# EAGLE design matrix+segmen_shalat (EAGLE 9.5.2)

## Sheet 1 of 2
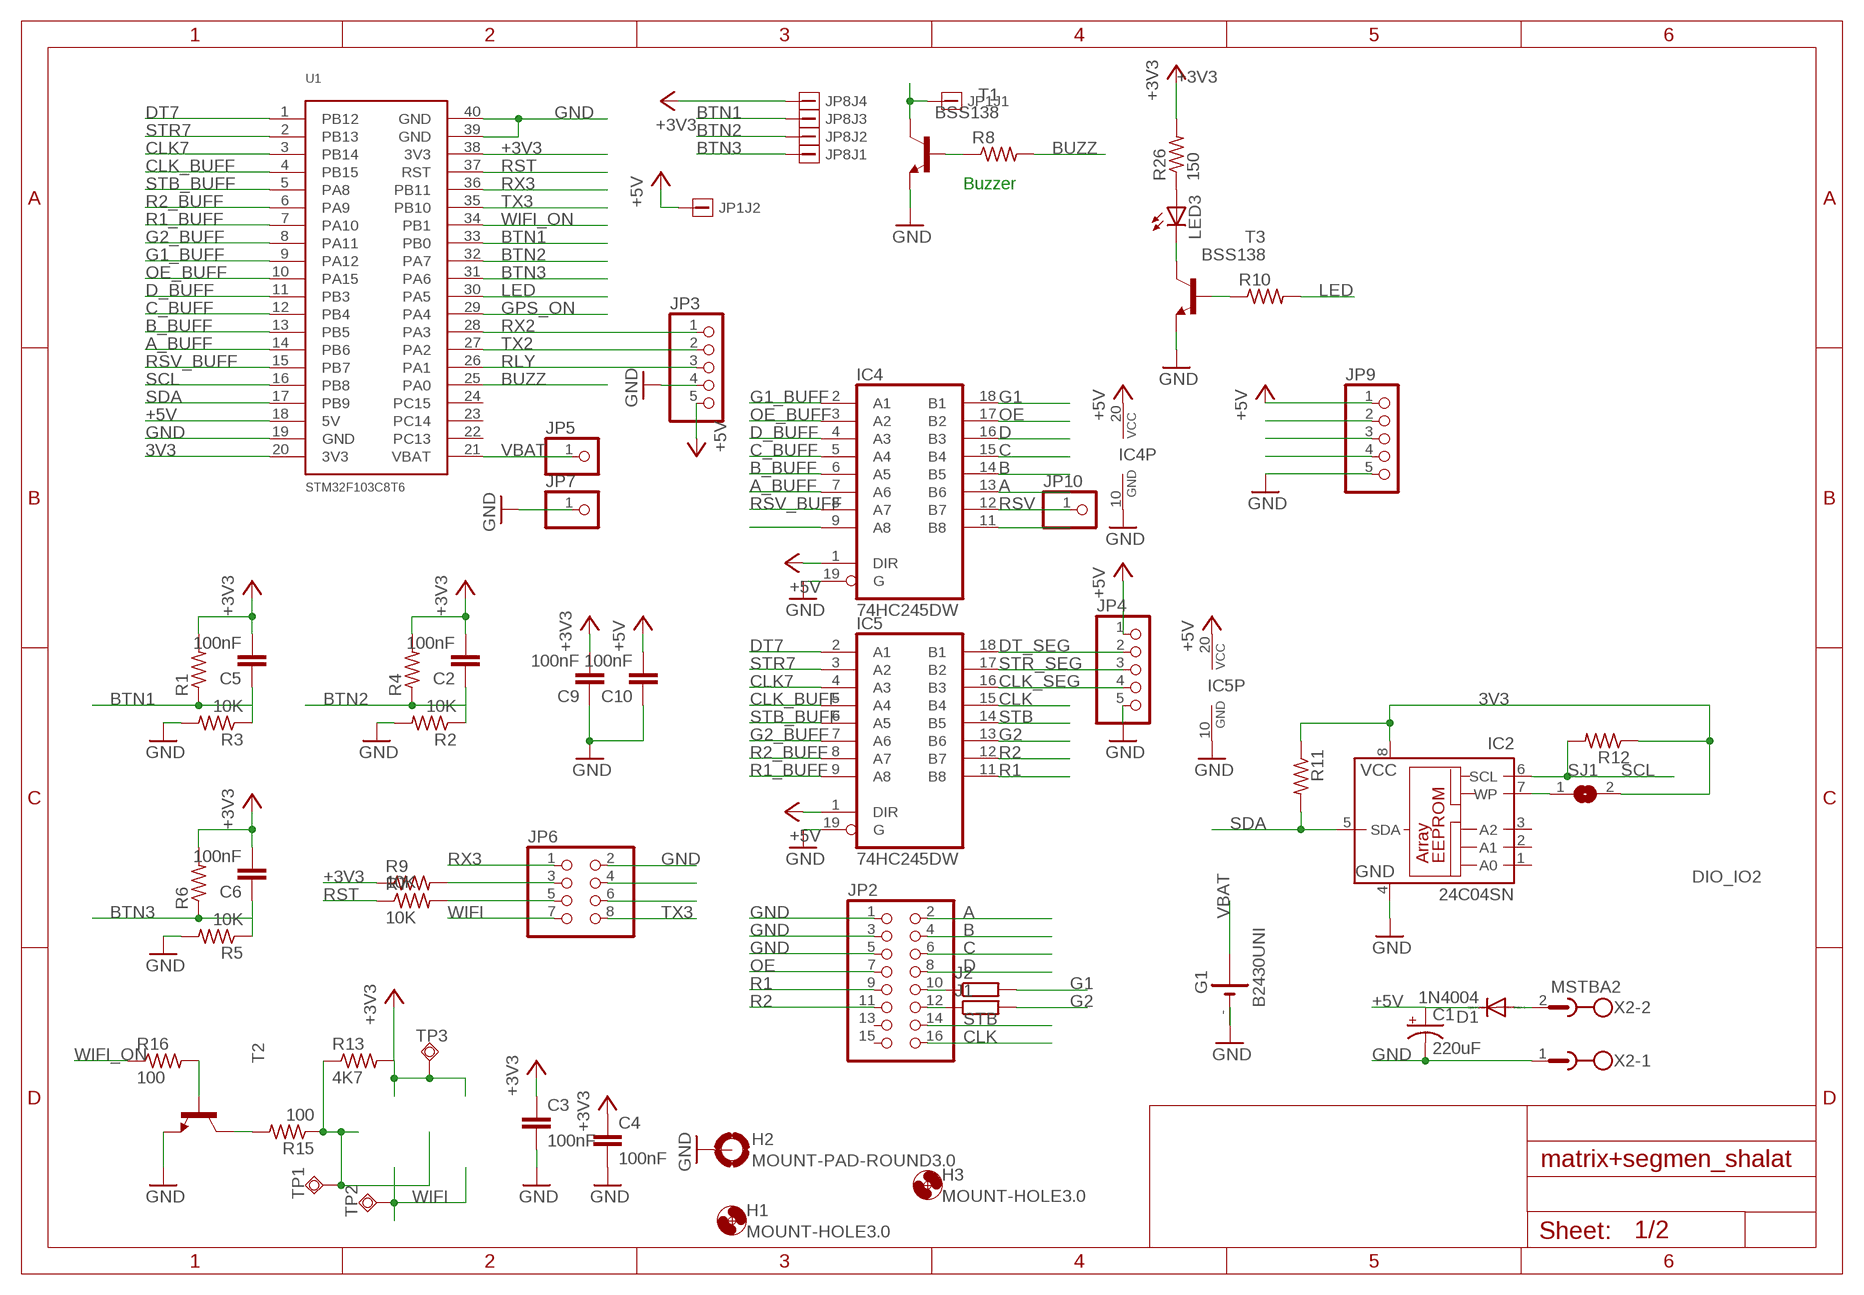
[diagram p0: schematic, sheet 1]

### Parts
C1  220uF  CPOL-USE3.5-8  [E3,5-8]
C2  100nF  C-EUC0805  [C0805]
C3  100nF  C-EUC0805  [C0805]
C4  100nF  C-EUC0805  [C0805]
C5  100nF  C-EUC0805  [C0805]
C6  100nF  C-EUC0805  [C0805]
C9  100nF  C-EUC0805  [C0805]
C10  100nF  C-EUC0805  [C0805]
D1  1N4004  [DO41-10]
G1  B2430UNI  [B2430UNI]
H1  MOUNT-HOLE3.0  [3,0]
H2  MOUNT-PAD-ROUND3.0  [3,0-PAD]
H3  MOUNT-HOLE3.0  [3,0]
IC2  24C04SN  [SO-08]
IC4  74HC245DW  [SO20W]
IC5  74HC245DW  [SO20W]
J1  R-EU_R0402  [R0402]
J2  R-EU_R0402  [R0402]
JP1  CON2-3.81  [CON2-3.81]
JP2  PINHD-2X8  [2X08]
JP3  PINHD-1X5  [1X05]
JP4  PINHD-1X5  [1X05]
JP5  PINHD-1X1  [1X01]
JP6  PINHD-2X4  [2X04]
JP7  PINHD-1X1  [1X01]
JP8  CON4-3.81  [CON4-3.81]
JP9  PINHD-1X5  [1X05]
JP10  PINHD-1X1  [1X01]
LED3  LED3MM  [LED3MM]
R1  R-US_0204/2V  [0204V]
R2  10K  R-US_M0805  [M0805]
R3  10K  R-US_M0805  [M0805]
R4  R-US_0204/2V  [0204V]
R5  10K  R-US_M0805  [M0805]
R6  R-US_0204/2V  [0204V]
R7  10K  R-US_R0805  [R0805]
R8  R-US_R0805  [R0805]
R9  10K  R-US_R0805  [R0805]
R10  R-US_R0805  [R0805]
R11  R-US_R0805  [R0805]
R12  R-US_R0805  [R0805]
R13  4K7  R-US_R0805  [R0805]
R15  100  R-US_R0805  [R0805]
R16  100  R-US_R0805  [R0805]
R26  150  R-US_R0805  [R0805]
SJ1  SJ  [SJ]
T1  BSS138  MMBT2222ALT1-NPN-SOT23-BEC  [SOT23-BEC]
T2  MMBT2222ALT1-NPN-SOT23-BEC  [SOT23-BEC]
T3  BSS138  MMBT2222ALT1-NPN-SOT23-BEC  [SOT23-BEC]
TP1  TPSQPAD1-13Y  [P1-13Y]
TP2  TPSQPAD1-13Y  [P1-13Y]
TP3  TPSQPAD1-13Y  [P1-13Y]
U1  STM32F103C8T6  [STM32F103]
X2  MSTBA2  [MSTBA2]

### Nets
3V3: IC2.8(VCC) R11.1 R12.1 SJ1.2 U1.20(3V3)
+3V3: C2.2 C3.1 C4.1 C5.2 C6.2 C9.2 JP8.4 R1.2 R4.2 R6.2 R9.1 R13.2 R26.2 TP3.TP U1.38(3V3)
+5V: C1.+ C10.2 D1.C IC4.1(DIR) IC4.20(VCC) IC5.1(DIR) IC5.20(VCC) JP1.2 JP3.5 JP4.1 JP9.1 U1.18(5V)
A: IC4.13(B6) JP2.2
A_BUFF: IC4.7(A6) U1.14(PB6)
B: IC4.14(B5) JP2.4
B_BUFF: IC4.6(A5) U1.13(PB5)
BTN1: C5.1 JP8.3 R1.1 R3.1 U1.33(PB0)
BTN2: C2.1 JP8.2 R2.1 R4.1 U1.32(PA7)
BTN3: C6.1 JP8.1 R5.1 R6.1 U1.31(PA6)
BUZZ: R8.2 U1.25(PA0)
C: IC4.15(B4) JP2.6
C_BUFF: IC4.5(A4) U1.12(PB4)
CLK: IC5.15(B4) JP2.16
CLK7: IC5.4(A3) U1.3(PB14)
CLK_BUFF: IC5.5(A4) U1.4(PB15)
CLK_SEG: IC5.16(B3) JP4.4
D: IC4.16(B3) JP2.8
D_BUFF: IC4.4(A3) U1.11(PB3)
DT7: IC5.2(A1) U1.1(PB12)
DT_SEG: IC5.18(B1) JP4.2
G1: IC4.18(B1) J2.2
G1_BUFF: IC4.2(A1) U1.9(PA12)
G2: IC5.13(B6) J1.2
G2_BUFF: IC5.7(A6) U1.8(PA11)
GND: C1.- C3.2 C4.2 C9.1 C10.1 G1.- G1.-@1(-) H2.B3,0(MOUNT) IC2.4(GND) IC4.10(GND) IC4.19(G) IC5.10(GND) IC5.19(G) JP2.1 JP2.3 JP2.5 JP3.4 JP4.5 JP6.2 JP7.1 JP9.5 R2.2 R3.2 R5.2 T1.E T2.E T3.E U1.19(GND) U1.39(GND) U1.40(GND) X2.1
GPS_ON: U1.29(PA4)
LED: R10.2 U1.30(PA5)
N$1: J1.1 JP2.12
N$2: IC4.9(A8)
N$3: LED3.K(C) T3.C
N$4: R10.1 T3.B
N$5: R8.1 T1.B
N$6: JP1.1 T1.C
N$7: JP6.3 R9.2
N$8: J2.1 JP2.10
N$9: IC4.11(B8)
N$10: JP6.4
N$13: JP9.2
N$14: JP9.3
N$15: JP9.4
N$17: R13.1 R15.1 TP1.TP
N$18: R15.2 T2.C
N$19: JP6.5 R7.2
N$20: JP6.6
N$21: R16.2 T2.B
N$29: LED3.A R26.1
N$41: D1.A X2.2
N$123: IC2.7(WP) SJ1.1
OE: IC4.17(B2) JP2.7
OE_BUFF: IC4.3(A2) U1.10(PA15)
R1: IC5.11(B8) JP2.9
R1_BUFF: IC5.9(A8) U1.7(PA10)
R2: IC5.12(B7) JP2.11
R2_BUFF: IC5.8(A7) U1.6(PA9)
RLY: JP3.3 U1.26(PA1)
RST: R7.1 U1.37(RST)
RSV: IC4.12(B7) JP10.1
RSV_BUFF: IC4.8(A7) U1.15(PB7)
RX2: JP3.1 U1.28(PA3)
RX3: JP6.1 U1.36(PB11)
SCL: IC2.6(SCL) R12.2 U1.16(PB8)
SDA: IC2.5(SDA) R11.2 U1.17(PB9)
STB: IC5.14(B5) JP2.14
STB_BUFF: IC5.6(A5) U1.5(PA8)
STR7: IC5.3(A2) U1.2(PB13)
STR_SEG: IC5.17(B2) JP4.3
TX2: JP3.2 U1.27(PA2)
TX3: JP6.8 U1.35(PB10)
VBAT: G1.+@4(+) JP5.1 U1.21(VBAT)
WIFI: JP6.7 TP2.TP
WIFI_ON: R16.1 U1.34(PB1)
Unconnected: IC2.1(A0) IC2.2(A1) IC2.3(A2) JP2.13 JP2.15 U1.22(PC13) U1.23(PC14) U1.24(PC15)

### Notes on the sheet
- Buzzer

## Sheet 2 of 2
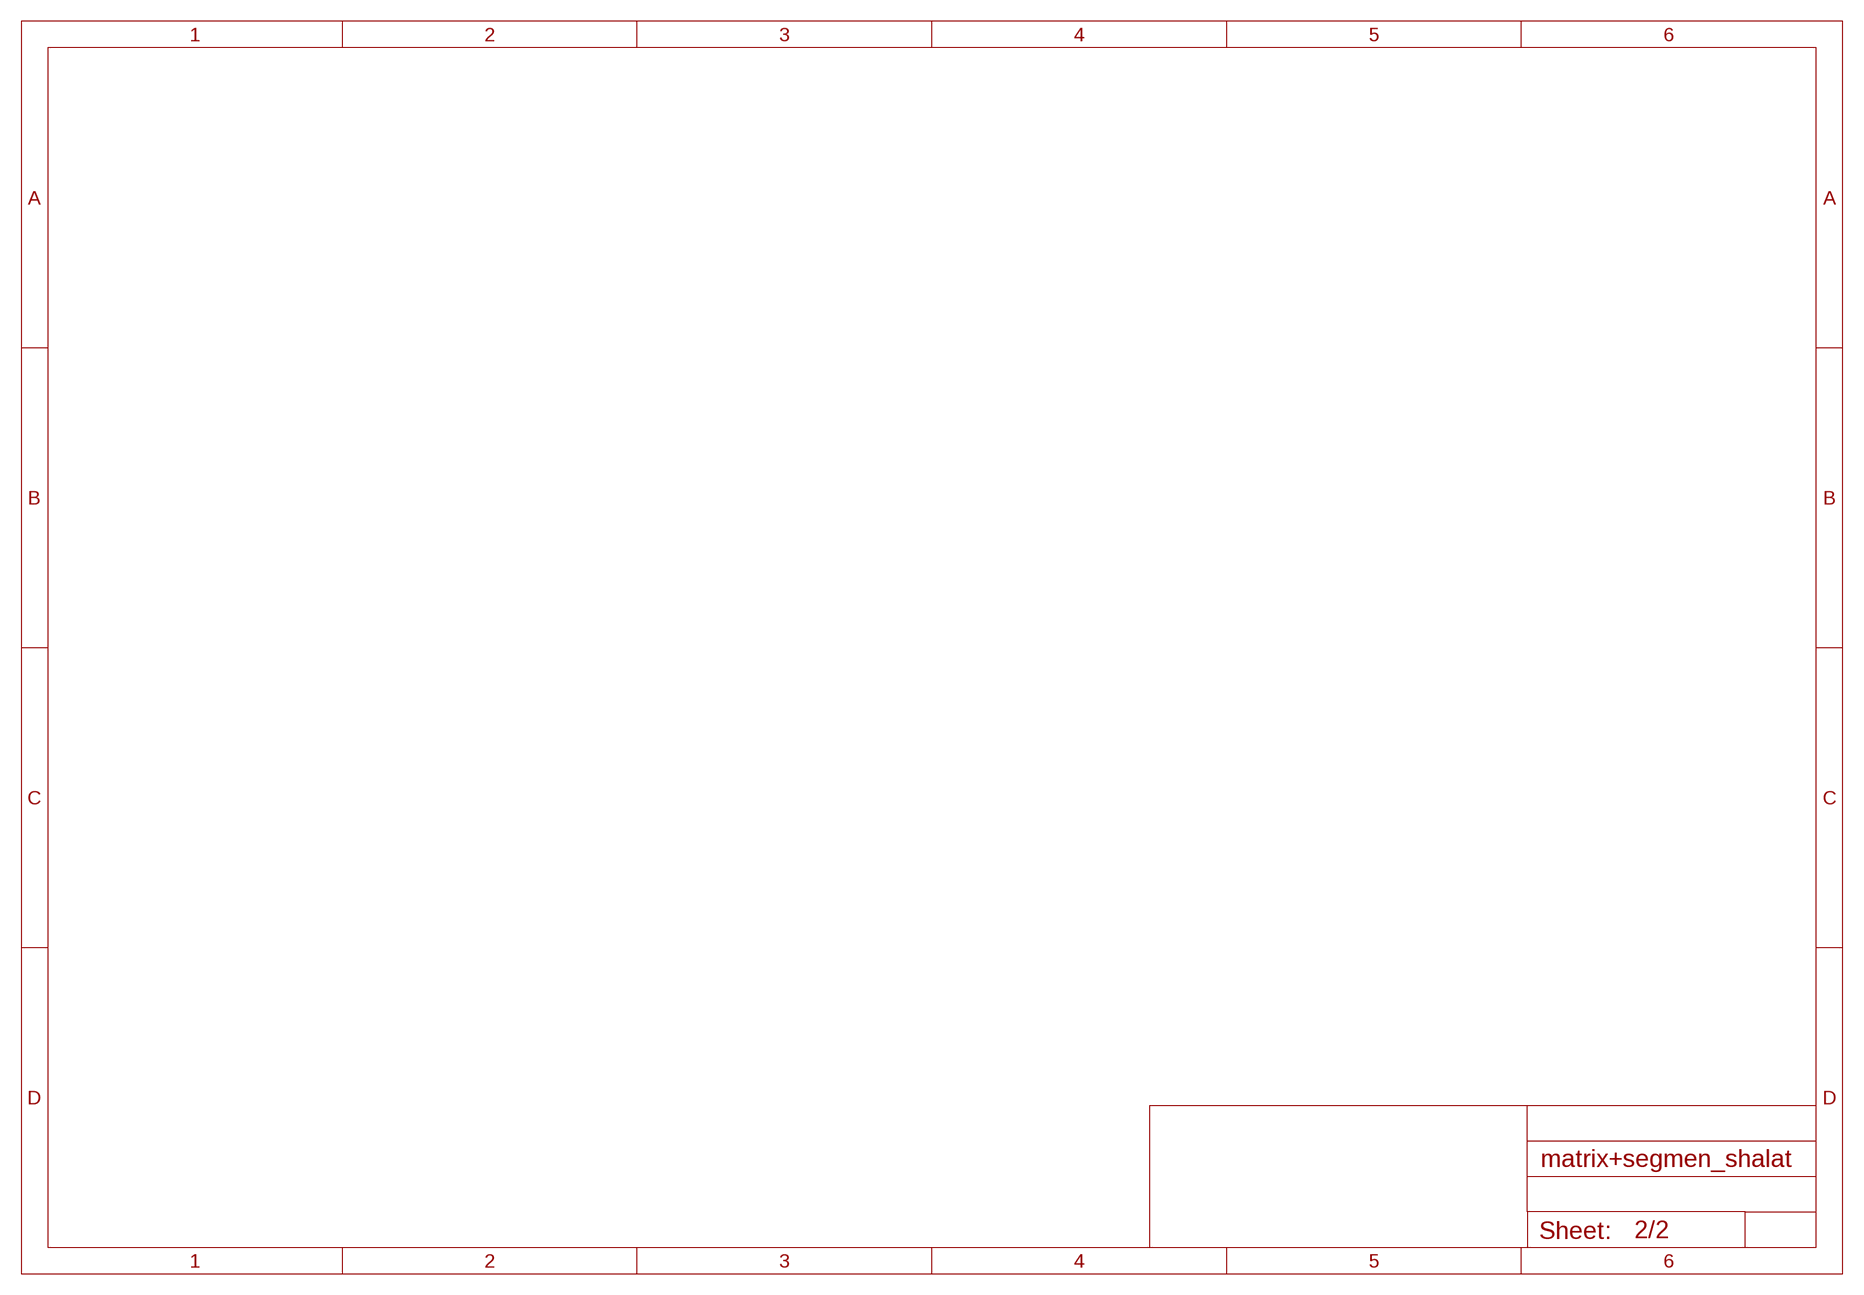
[diagram p1: schematic, sheet 2]

## Library data of the parts
C1 = rcl:CPOL-US: POLARIZED CAPACITOR, American symbol
C2 C5 C6 C9 C10 = resistor:C-EU: CAPACITOR, European symbol
C3 C4 = rcl:C-EU: CAPACITOR, European symbol
D1 = diode:1N4004: DIODE general purpose rectifier, 1 A
G1 = battery:B2430UNI: LI BATTERY
H1 H3 = holes:MOUNT-HOLE: MOUNTING HOLE with drill center marker
H2 = holes:MOUNT-PAD-ROUND: MOUNTING PAD, round
IC2 = microchip:24C*: Serial EEPROM 1 K/2 K/4 K; MPN: M24C04-WMN6P; OC_FARNELL: 9882812; OC_NEWARK: 83K1376
IC4 IC5 = 74xx-eu:74*245: Octal BUS TRANSCEIVER, 3-state
J1 J2 = rcl:R-EU_: RESISTOR, European symbol; SPICEPREFIX: R
JP1 = IyunLib:CON2-3.81
JP2 = pinhead:PINHD-2X8: PIN HEADER
JP3 JP4 JP9 = pinhead:PINHD-1X5: PIN HEADER
JP5 JP7 JP10 = pinhead:PINHD-1X1: PIN HEADER
JP6 = pinhead:PINHD-2X4: PIN HEADER
JP8 = IyunLib:CON4-3.81
LED3 = led:LED: LED OSRAM: - CHIPLED LG R971, LG N971, LY N971, LG Q971, LY Q971, LO R971, LY R971 LH N974, LH R974 LS Q976, LO Q976, LY Q976 LO Q996 - Hyper CHIPLED LW Q18S LB Q993, LB Q99A, LB R99A - SideLED LS A670, LO A670, LY A670, LG A670, LP A670 LB A673, LV A673, LT A673, LW A673 LH A674 LY A675 LS A676, LA A676, LO A676, LY A676, LW A676 LS A679, LY A679, LG A679 - Hyper Micro SIDELED® LS Y876, LA Y876, LO Y876, LY Y876 LT Y87S - SmartLED LW L88C, LW L88S LB L89C, LB L89S, LG L890 LS L89K, LO L89K, LY L89K LS L896, LA L896, LO L896, LY L896 - TOPLED LS T670, LO T670, LY T670, LG T670, LP T670 LSG T670, LSP T670, LSY T670, LOP T670, LYG T670 LG T671, LOG T671, LSG T671 LB T673, LV T673, LT T673, LW T673 LH T674 LS T676, LA T676, LO T676, LY T676, LB T676, LH T676, LSB T676, LW T676 LB T67C, LV T67C, LT T67C, LS T67K, LO T67K, LY T67K, LW E67C LS E67B, LA E67B, LO E67B, LY E67B, LB E67C, LV E67C, LT E67C LW T67C LS T679, LY T679, LG T679 LS T770, LO T770, LY T770, LG T770, LP T770 LB T773, LV T773, LT T773, LW T773 LH T774 LS E675, LA E675, LY E675, LS T675 LS T776, LA T776, LO T776, LY T776, LB T776 LHGB T686 LT T68C, LB T68C - Hyper Mini TOPLED® LB M676 - Mini TOPLED Santana® LG M470 LS M47K, LO M47K, LY M47K Source: http://www.osram.convergy.de LUXEON: - LUMILED® LXK2-PW12-R00, LXK2-PW12-S00, LXK2-PW14-U00, LXK2-PW14-V00 LXK2-PM12-R00, LXK2-PM12-S00, LXK2-PM14-U00 LXK2-PE12-Q00, LXK2-PE12-R00, LXK2-PE12-S00, LXK2-PE14-T00, LXK2-PE14-U00 LXK2-PB12-K00, LXK2-PB12-L00, LXK2-PB12-M00, LXK2-PB14-N00, LXK2-PB14-P00, LXK2-PB14-Q00 LXK2-PR12-L00, LXK2-PR12-M00, LXK2-PR14-Q00, LXK2-PR14-R00 LXK2-PD12-Q00, LXK2-PD12-R00, LXK2-PD12-S00 LXK2-PH12-R00, LXK2-PH12-S00 LXK2-PL12-P00, LXK2-PL12-Q00, LXK2-PL12-R00 Source: www.luxeon.com KINGBRIGHT: KA-3528ASYC Source: www.kingbright.com
R1 R4 R6 = rcl:R-US_: RESISTOR, American symbol; SPICEPREFIX: R
R2 R3 R5 R7-R13 R15 R16 R26 = rcl:R-US_: RESISTOR, American symbol
SJ1 = jumper:SJ: SMD solder JUMPER
T1-T3 = transistor:*-NPN-: NPN Transistror BF959 corrected 2008.03.06
TP1-TP3 = testpad:TPSQ: Test pad
U1 = IyunLib:STM32F103C8T6
X2 = con-phoenix-508:MSTBA2: PHOENIX; MF: FARNELL; MPN: 1757242; OC_FARNELL: 3705171; OC_NEWARK: 71C4161

## Board
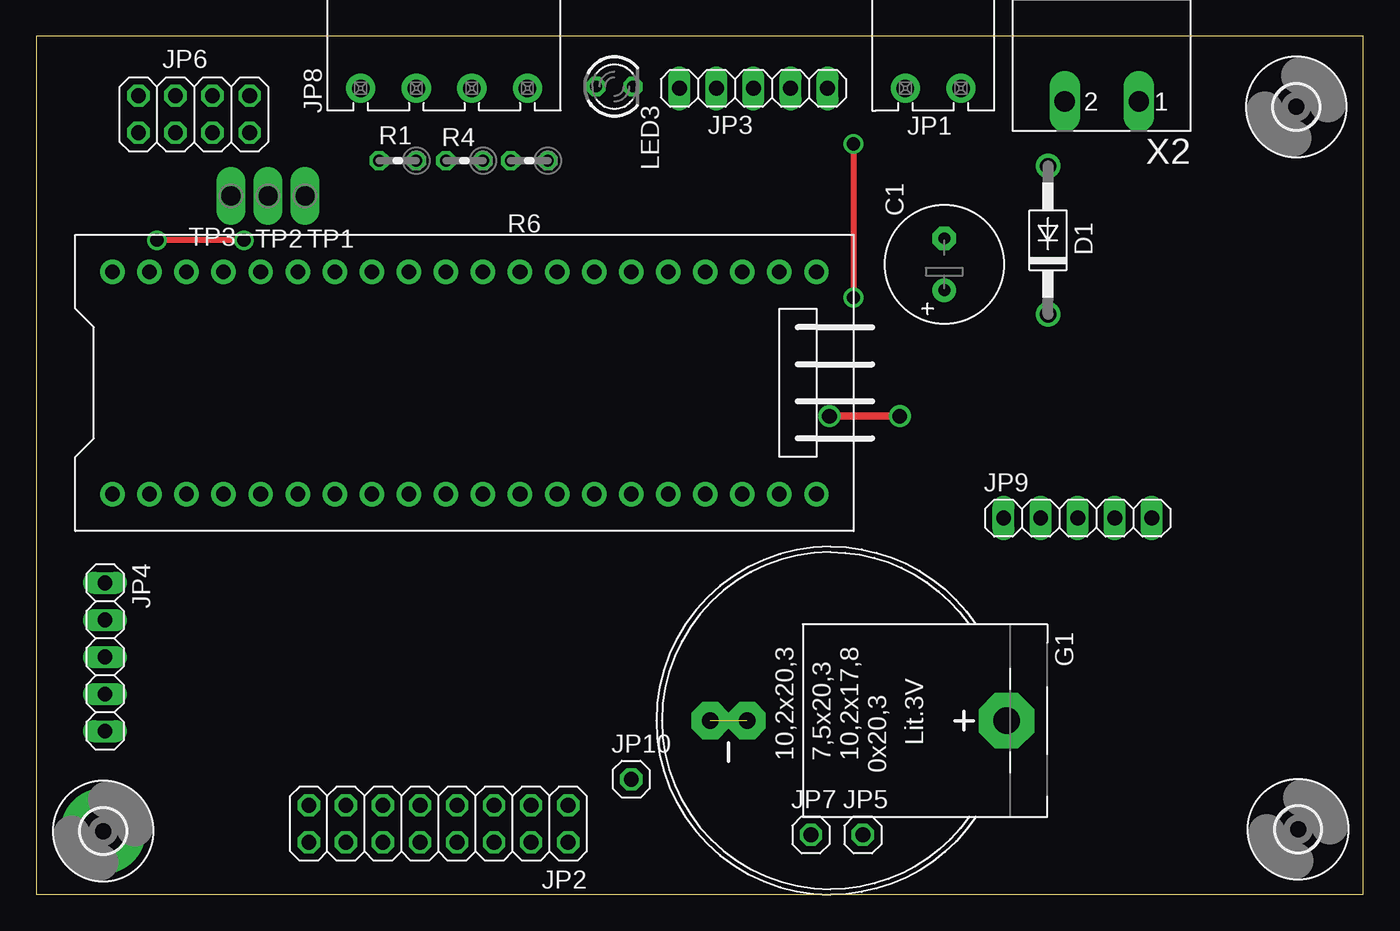
[diagram p2: board, top side]
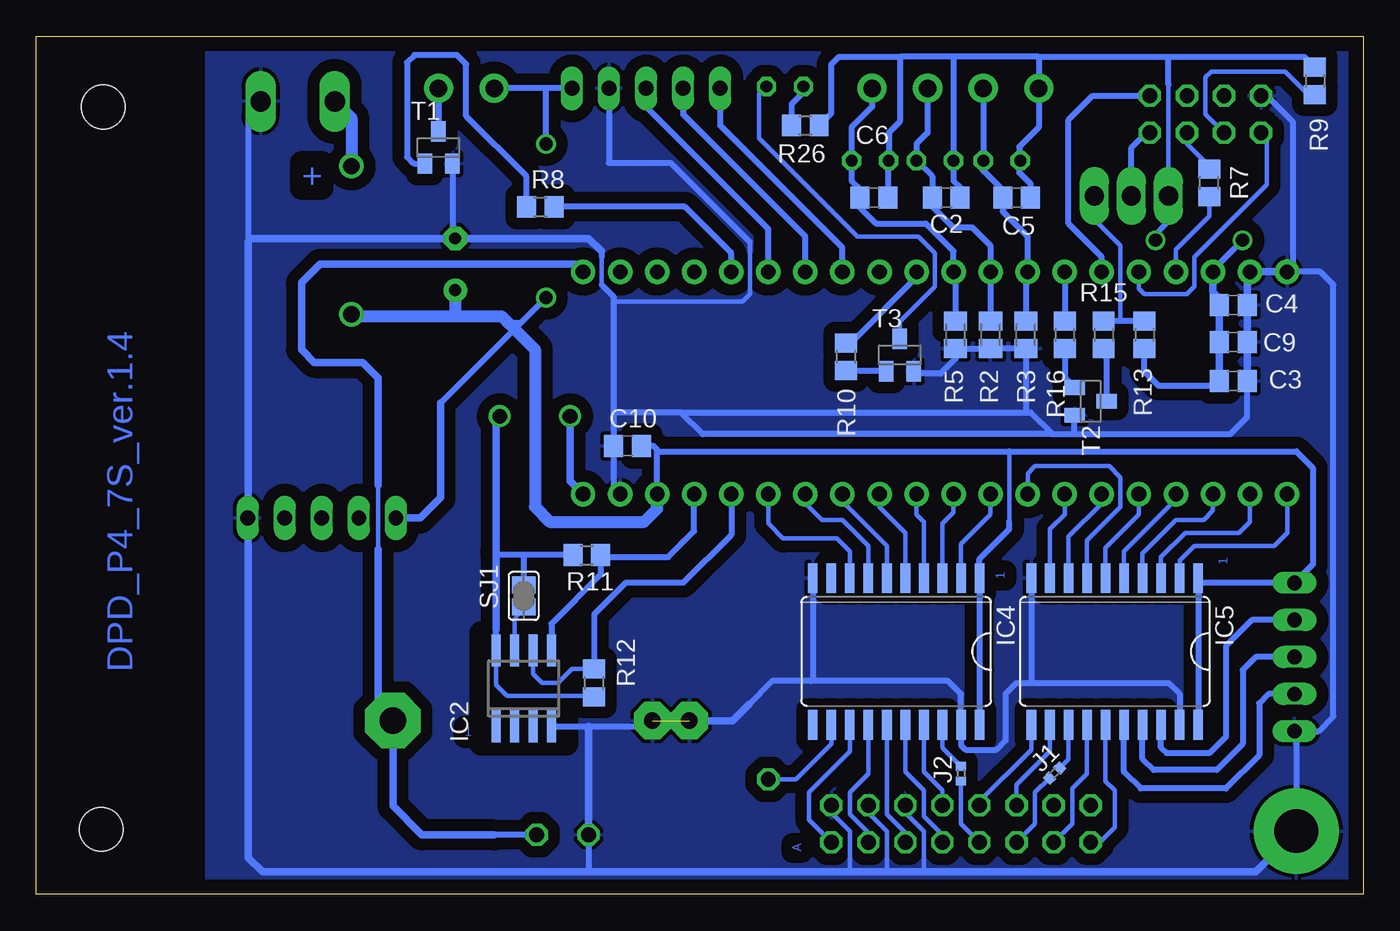
[diagram p3: board, bottom side, seen from below]

Size 90.93 x 58.8 mm. Coordinates in mm from the lower left corner, seen from the top.
Outline: 0,0 90.93,0 90.93,58.8 0,58.8 0,0
Copper layers (1*16): Top 0.035mm / dielectric 1.5mm / Bottom 0.035mm
Design rules "default": minimum track width 10mil, minimum drill 24mil, track to track 8mil, track to pad 8mil, pad to pad 8mil, via to via 8mil, smd to smd 8mil, copper to edge 40mil, drill to drill 8mil, minimum pad ring 10mil, minimum via ring 8mil, stop-mask expansion 4mil, vias tented up to drill 0mil, thermal gap 10mil
bRestrict: area 54.6,10.3 to 60.5,17.9

### Footprints (pad centres in the part's own frame; a part is rotated, then mirrored left to right if it is on the bottom)
E3,5-8 = drill 0.813 pad 1.6: + -1.778,0 | drill 0.813 pad 1.6 octagon: - 1.778,0
C0805 = smd 1.3 x 1.5: 1 -0.95,0; 2 0.95,0
DO41-10 = drill 1.118: A 5.08,0; C -5.08,0
B2430UNI = drill 1.803 pad 3.81 octagon: +@4 0,12.065 | drill 1.118 pad 2.54 octagon: - 0,-5.715; -@1 0,-8.255
3,0 = hole 3: 0,0
3,0-PAD = drill 3 pad 5.842: B3,0 0,0
SO-08 = smd 0.6 x 2.2: 1 -1.905,-2.6; 2 -0.635,-2.6; 3 0.635,-2.6; 4 1.905,-2.6; 5 1.905,2.6; 6 0.635,2.6; 7 -0.635,2.6; 8 -1.905,2.6
SO20W = smd 0.66 x 2.032: 1 -5.715,-5.029; 2 -4.445,-5.029; 3 -3.175,-5.029; 4 -1.905,-5.029; 5 -0.635,-5.029; 6 0.635,-5.029; 7 1.905,-5.029; 8 3.175,-5.029; 9 4.445,-5.029; 10 5.715,-5.029; 11 5.715,5.029; 12 4.445,5.029; 13 3.175,5.029; 14 1.905,5.029; 15 0.635,5.029; 16 -0.635,5.029; 17 -1.905,5.029; 18 -3.175,5.029; 19 -4.445,5.029; 20 -5.715,5.029
R0402 = smd 0.6 x 0.7: 1 -0.5,0; 2 0.5,0
CON2-3.81 = drill 1.2 pad 2: 1 -2.54,0; 2 1.27,0
2X08 = drill 1.016 octagon: 1 -8.89,-1.27; 2 -8.89,1.27; 3 -6.35,-1.27; 4 -6.35,1.27; 5 -3.81,-1.27; 6 -3.81,1.27; 7 -1.27,-1.27; 8 -1.27,1.27; 9 1.27,-1.27; 10 1.27,1.27; 11 3.81,-1.27; 12 3.81,1.27; 13 6.35,-1.27; 14 6.35,1.27; 15 8.89,-1.27; 16 8.89,1.27
1X05 = drill 1.016 long: 1 -5.08,0; 2 -2.54,0; 3 0,0; 4 2.54,0; 5 5.08,0
1X01 = drill 1.016 octagon: 1 0,0
2X04 = drill 1.016 octagon: 1 -3.81,-1.27; 2 -3.81,1.27; 3 -1.27,-1.27; 4 -1.27,1.27; 5 1.27,-1.27; 6 1.27,1.27; 7 3.81,-1.27; 8 3.81,1.27
CON4-3.81 = drill 1.2 pad 2: 1 -5.08,0; 2 -1.27,0; 3 2.54,0; 4 6.35,0
LED3MM = drill 0.813 octagon: A -1.27,0; K 1.27,0
0204V = drill 0.813 octagon: 1 -1.27,0; 2 1.27,0
M0805 = smd 1.3 x 1.6: 1 -0.95,0; 2 0.95,0
R0805 = smd 1.3 x 1.5: 1 -0.95,0; 2 0.95,0
SJ = smd 1.168 x 1.6: 1 -0.762,0; 2 0.762,0
SOT23-BEC = smd 1 x 1.4: B -0.95,-1.1; C 0,1.1; E 0.95,-1.1
P1-13Y = drill 1.321 pad 1.905 long: TP 0,0
STM32F103 = drill 1 pad 1.676: 1 -7.62,24.13; 2 -7.62,21.59; 3 -7.62,19.05; 4 -7.62,16.51; 5 -7.62,13.97; 6 -7.62,11.43; 7 -7.62,8.89; 8 -7.62,6.35; 9 -7.62,3.81; 10 -7.62,1.27; 11 -7.62,-1.27; 12 -7.62,-3.81; 13 -7.62,-6.35; 14 -7.62,-8.89; 15 -7.62,-11.43; 16 -7.62,-13.97; 17 -7.62,-16.51; 18 -7.62,-19.05; 19 -7.62,-21.59; 20 -7.62,-24.13; 21 7.62,-24.13; 22 7.62,-21.59; 23 7.62,-19.05; 24 7.62,-16.51; 25 7.62,-13.97; 26 7.62,-11.43; 27 7.62,-8.89; 28 7.62,-6.35; 29 7.62,-3.81; 30 7.62,-1.27; 31 7.62,1.27; 32 7.62,3.81; 33 7.62,6.35; 34 7.62,8.89; 35 7.62,11.43; 36 7.62,13.97; 37 7.62,16.51; 38 7.62,19.05; 39 7.62,21.59; 40 7.62,24.13
MSTBA2 = drill 1.397 long: 1 -2.54,5.08; 2 2.54,5.08

### Placement (x,y rotation side)
C1  62.23,43.18 90 top
C2  28.57,47.75 0 bottom
C3  8.89,35.18 0 bottom
C4  8.89,40.39 0 bottom
C5  23.75,47.75 0 bottom
C6  33.53,47.75 0 bottom
C9  8.89,37.85 180 bottom
C10  50.42,30.73 0 bottom
D1  69.34,44.83 90 top
G1  54.43,11.89 270 top
H1  86.49,4.45 0 top
H2  4.57,4.32 0 top
H3  86.36,53.98 0 top
IC2  57.53,14.1 0 bottom
IC4  32,16.64 180 bottom
IC5  17.02,16.64 180 bottom
J1  21.14,8.3 45 bottom
J2  27.56,8.25 90 bottom
JP1  60.83,55.24 180 top
JP2  27.56,4.83 180 top
JP3  49.15,55.24 0 top
JP4  4.7,16.26 270 top
JP5  56.64,4.06 0 top
JP6  10.79,53.47 0 top
JP7  53.09,4.06 0 top
JP8  28.57,55.24 180 top
JP9  71.37,25.78 0 top
JP10  40.77,7.87 0 top
LED3  39.62,55.37 0 top
R1  24.77,50.29 180 top
R2  25.53,38.35 270 bottom
R3  23.11,38.35 270 bottom
R4  29.34,50.29 180 top
R5  27.94,38.35 270 bottom
R6  33.78,50.29 180 top
R7  10.54,48.77 90 bottom
R8  56.39,47.12 0 bottom
R9  3.3,55.75 270 bottom
R10  35.43,36.83 90 bottom
R11  53.21,23.24 0 bottom
R12  52.7,14.48 90 bottom
R13  14.99,38.35 270 bottom
R15  17.78,38.35 270 bottom
R16  20.45,38.35 270 bottom
R26  38.23,52.7 0 bottom
SJ1  57.53,20.45 90 bottom
T1  63.37,51.18 0 bottom
T2  18.67,33.78 270 bottom
T3  31.75,36.96 0 bottom
TP1  18.41,47.88 0 top
TP2  15.88,47.88 0 top
TP3  13.34,47.88 0 top
U1  29.34,35.05 90 top
X2  73.02,59.44 180 top

### Tracks (layer width: path | path; a pad name or v marks a point on that pad's centre or on a via)
3V3  (via drill 1)
  Top 0.508: v54.36,32.77 v59.18,32.77 58.17,32.77
  Bottom 0.305: R12.1 52.77,13.59 58.67,13.59 59.44,14.35 IC2.8
  Bottom 0.406: R11.1 57.53,23.24 | 59.44,24.26 59.44,23.5 | 57.53,23.24 SJ1.2 | 57.53,23.24 59.31,23.24 | 59.31,23.24 59.44,23.24 | IC2.8 59.44,18.16 59.44,23.11 59.31,23.24
  Bottom 0.508: U1.20 54.36,28.32 v54.36,32.77 | 54.36,23.24 R11.1 | v59.18,32.77 59.44,32.51 59.44,23.5 59.44,23.24 59.44,18.16
+3V3  (via drill 0.9)
  Top 0.406: v14.22,44.83 v8.25,44.83
  Bottom 0.305: 13.34,46.35 TP3.TP 13.34,55.5
  Bottom 0.406: 22.8,47.43 C5.2 22.8,48.71 23.56,49.47 23.56,50.23 R1.2 23.56,50.36 23.56,51.24 22.23,52.58 JP8.4 22.23,57.4 | C6.2 32.58,50.23 R6.2 32.51,52.2 31.75,52.96 31.75,57.4 | C2.2 27.62,48.45 28.07,48.89 R4.2 28.07,57.4 | 22.23,57.4 28.07,57.4 | C3.1 10.16,34.86 14.03,34.86 14.99,35.81 R13.2 | R9.1 4,57.4 13.34,57.4 | 22.23,57.4 13.34,57.4 | 13.34,55.5 13.34,57.4 | 28.07,57.4 31.75,57.4 | R26.2 36.45,53.53 36.45,56.9 35.94,57.4 31.75,57.4 | TP3.TP 13.34,46.1 14.48,44.96 14.35,44.83 v14.22,44.83 | v8.25,44.83 10.29,42.8 U1.38
  Bottom 0.508: U1.38 10.29,41.27 9.84,40.83 C4.1 C9.2 C3.1
+5V  (via drill 0.9)
  Top 0.406: v56.01,51.44 v56.01,40.89
  Bottom 0.305: 24.26,25.53 24.26,30.35
  Bottom 0.406: 48.39,27.81 U1.18 48.39,30.35 | IC4.20 IC4.1 26.29,22.99 24.26,25.02 24.26,25.53 | IC5.1 11.3,21.34 | 11.3,21.34 IC5.20 | 59.05,39.62 58.86,39.43 | 11.3,21.34 JP4.1 3.43,22.61 3.43,29.21 4.57,30.35 24.26,30.35 48.39,30.35 | 63.25,33.66 v56.01,40.89 57.72,39.18 58.61,39.18 | C10.2 48.64,30.73 48.39,30.48 48.39,30.35 | JP3.5 56.01,55.24 | 56.01,55.24 JP1.2 | v56.01,51.44 56.01,55.24
  Bottom 0.508: JP9.1 64.64,25.78 63.25,27.18 63.25,33.66
  Bottom 0.813: 62.23,39.62 59.05,39.62 58.61,39.18 56.77,37.34 56.77,26.54 55.75,25.53 49.28,25.53 48.39,26.42 U1.18 | D1.C 69.22,39.62 62.23,39.62 | C1.+ 62.23,39.62
A
  Bottom 0.305: JP2.2 37.97,5.08 37.97,6.98 35.18,9.78 IC4.13
A_BUFF
  Bottom 0.305: U1.14 38.23,26.8 37.08,25.65 35.69,25.65 33.91,23.88 IC4.7
B
  Bottom 0.305: JP2.4 33.91,4.19 35.18,5.46 35.18,6.98 33.91,8.25 IC4.14
B_BUFF
  Bottom 0.305: U1.13 35.69,26.92 32.64,23.88 IC4.6
BTN1
  Bottom 0.406: JP8.3 R1.1 26.04,49.6 24.7,48.26 C5.1 24.7,46.8 22.99,45.09 U1.33 23.11,42.55 R3.1
BTN2
  Bottom 0.406: C2.1 29.52,49.21 R4.1 30.61,51.44 29.84,52.2 JP8.2 | 29.84,47.75 C2.1 | C2.1 29.27,47.5 | C2.1 29.52,47.12 28.13,45.72 26.8,45.72 25.53,44.45 U1.32 R2.1
BTN3
  Bottom 0.406: R5.1 27.94,42.42 28.07,42.55 U1.31 28.07,44.07 29.97,45.97 33.4,45.97 34.48,47.05 C6.1 34.48,48.32 35.05,48.89 R6.1 35.05,52.58 33.66,53.98 JP8.1
BUZZ
  Bottom 0.406: U1.25 43.31,43.94 46.48,47.12 R8.2
C
  Bottom 0.305: JP2.6 31.37,4.19 32.64,5.46 IC4.15
C_BUFF
  Bottom 0.305: U1.12 33.15,26.54 31.37,24.77 IC4.5
CLK
  Bottom 0.305: JP2.16 18.03,3.56 17.02,4.57 17.02,7.11 17.65,7.75 IC5.15
CLK7
  Bottom 0.305: IC5.4 15.11,23.37 12.83,25.65 10.92,25.65 10.29,26.29 U1.3
CLK_BUFF
  Bottom 0.305: U1.4 12.83,27.05 16.38,23.5 IC5.5
CLK_SEG
  Bottom 0.406: JP4.4 6.48,13.72 7.11,13.08 7.11,9.53 9.4,7.24 15.24,7.24 16.38,8.38 IC5.16
D
  Bottom 0.305: JP2.8 28.83,4.06 30.1,5.33 30.1,7.11 31.37,8.38 IC4.16
D_BUFF
  Bottom 0.305: U1.11 30.61,26.04 30.1,25.53 IC4.4
DT7
  Bottom 0.305: IC5.2 12.57,22.86 11.56,23.88 6.1,23.88 5.21,24.77 U1.1
DT_SEG
  Bottom 0.406: JP4.2 7.62,18.8 9.4,17.02 9.4,10.79 10.54,9.65 13.46,9.65 13.84,10.03 IC5.18
G1
  Bottom 0.305: IC4.18 28.83,10.03 J2.2
G1_BUFF
  Bottom 0.305: IC4.2 27.56,24 25.53,26.04 U1.9
G2
  Bottom 0.305: J1.2 20.19,9.25 IC5.13
G2_BUFF
  Bottom 0.305: IC5.7 18.92,24.26 16.64,26.54 16.64,28.57 17.4,29.34 22.48,29.34 22.99,28.83 U1.8
GND  (1 unrouted)
  Bottom 0.305: 52.2,41.78 52.2,43.69 | 35.94,1.65 35.81,1.52 | JP2.5 31.37,5.59 30.1,4.32 30.1,1.52 | JP2.3 33.91,5.59 32.64,4.32 32.64,1.52 | JP2.1 36.45,5.59 35.18,4.32 35.18,1.65 35.31,1.52 | 51.37,40.77 51.24,40.64 42.54,40.64 42.04,41.15 42.04,44.7 | JP9.5 76.41,25.73 76.41,5.08
  Bottom 0.406: 52.2,44.07 52.2,43.69 | U1.19 51.37,27.87 C10.1 51.37,33.02 | 52.2,41.78 51.37,40.95 51.37,40.77 51.37,33.02 | IC5.19 12.57,13.72 13.34,14.48 22.61,14.48 | 22.61,14.48 23.75,14.48 24.51,13.72 24.51,10.54 25.15,9.91 27.25,9.91 27.56,10.21 IC4.19 27.56,13.72 28.45,14.6 37.85,14.6 | 22.73,21.97 IC5.10 22.73,14.6 22.61,14.48 | 46.74,33.02 51.37,33.02 | H2.B3,0 4.57,11.05 JP4.5 3.05,11.18 2.03,12.19 2.03,41.78 2.92,42.67 4.95,42.67 | 37.85,14.6 40.51,14.6 42.1,13.02 42.16,12.95 | 23.05,33.02 23.11,33.09 R3.2 R2.2 R5.2 27.94,36.7 28.96,35.69 30.63,35.69 T3.E | 21.3,31.53 22.79,33.02 23.05,33.02 | 21.3,31.53 19.81,31.53 | 19.81,31.53 9.11,31.53 7.94,32.7 C3.2 | T2.E 19.81,32.79 19.81,31.53 | JP3.4 51.69,50.14 47.47,50.14 42.04,44.7 | X2.1 76.41,53.52 76.41,42.16 | IC2.4 53.09,11.5 49.11,11.5 G1.- 47.95,11.89 | 4.95,42.67 U1.40 | 46.74,33.02 23.05,33.02 | JP6.2 6.6,54.74 4.83,52.96 4.83,42.8 4.95,42.67 | JP7.1 53.09,1.65 52.96,1.52 | IC4.10 37.72,14.73 37.85,14.6 | 21.3,31.53 45.24,31.53 46.74,33.02 | T1.E 62.42,45.15 C1.-
  Bottom 0.508: 52.2,44.07 53.09,44.96 C1.- 76.2,44.96 76.41,44.75 76.41,42.16 76.41,5.08 76.41,2.49 75.44,1.52 52.96,1.52 42.21,1.52 | 42.08,1.52 35.81,1.52 35.31,1.52 32.64,1.52 30.1,1.52 7.37,1.52 H2.B3,0 | U1.40 U1.39 7.94,42.48 C4.2 C9.1 C3.2 | 42.1,13.02 43.22,11.89 47.95,11.89 | JP7.1 53.09,11.5
  pour Bottom (isolate 0.813): 0.38,58.55 79.25,58.55 79.25,0.13 0.38,0.13
LED
  Bottom 0.406: U1.30 30.61,42.29 35.12,37.78 R10.2
N$1
  Bottom 0.305: J1.1 22.48,6.96 22.48,4.83 JP2.12
N$3
  Bottom 0.305: LED3.K 41.4,54.86 41.4,51.82 34.67,45.09 30.48,45.09 29.34,43.94 29.34,41.66 31.75,39.24 T3.C
N$4
  Bottom 0.406: T3.B 35.41,35.86 R10.1
N$5
  Bottom 0.406: R8.1 57.34,49.21 61.47,53.34 61.47,56.9 62.1,57.53 65.02,57.53 65.53,57.02 65.53,50.55 65.07,50.08 T1.B
N$6
  Bottom 0.406: JP1.1 T1.C
N$7
  Bottom 0.305: JP6.3 10.79,53.47 10.79,56.01 10.41,56.39 5.33,56.39 3.75,54.8 R9.2
N$8
  Bottom 0.305: JP2.10 27.56,4.83 J2.1
N$17
  Bottom 0.305: TP1.TP 18.41,46.23 16.64,44.45 16.64,39.43 16.51,39.3
  Bottom 0.406: R13.1 16.51,39.3 R15.1
N$18
  Bottom 0.406: T2.C 17.57,37.19 R15.2
N$19
  Bottom 0.305: R7.2 10.54,49.91 12.06,51.44 JP6.5
N$21
  Bottom 0.406: R16.2 20.45,35.41 T2.B
N$29
  Bottom 0.406: R26.1 39.18,54.17 38.35,54.99 LED3.A
N$41
  Bottom 0.813: X2.2 69.34,53.21 D1.A
N$123
  Bottom 0.305: IC2.7 58.17,18.84 SJ1.1
OE
  Bottom 0.305: 28.83,6.48 JP2.7 28.83,7.11 30.1,8.38 IC4.17
OE_BUFF
  Bottom 0.305: U1.10 28.07,26.16 28.83,25.4 IC4.3
R1
  Bottom 0.305: IC5.11 22.73,9.91 26.29,6.35 JP2.9
R1_BUFF
  Bottom 0.305: IC5.9 21.46,25.02 20.45,26.04 U1.7
R2
  Bottom 0.305: JP2.11 23.75,7.49 21.46,9.78 IC5.12
R2_BUFF
  Bottom 0.305: IC5.8 20.19,24.51 17.91,26.8 U1.6
RLY
  Bottom 0.406: U1.26 40.77,45.59 49.15,53.98 JP3.3
RST
  Bottom 0.305: U1.37 12.83,44.2 10.54,46.48 R7.1
RSV
  Bottom 0.305: IC4.12 36.45,10.29 38.86,7.87 JP10.1
RSV_BUFF
  Bottom 0.305: IC4.8 35.18,23.5 36.07,24.38 39.75,24.38 40.77,25.4 U1.15
RX2
  Bottom 0.406: U1.28 35.69,44.32 44.07,52.7 JP3.1
RX3
  Bottom 0.305: U1.36 15.37,41.53 14.99,41.15 12.06,41.15 11.56,41.66 11.56,43.69 6.6,48.64 6.6,51.82 JP6.1
SCL
  Bottom 0.305: IC2.6 56.9,15.11 56.26,14.48 55.18,14.48 54.23,15.43 R12.2
  Bottom 0.406: 52.7,15.37 R12.2 52.7,19.18 50.55,21.34 46.61,21.34 43.31,24.64 U1.16
SDA
  Bottom 0.406: 55.63,16.89 IC2.5 55.63,18.54 52.26,21.91 R11.2 | R11.2 52.2,23.24 | U1.17 45.85,24.89 47.62,23.11 52.14,23.11 R11.2
STB
  Bottom 0.305: JP2.14 19.94,4.83 19.94,7.24 18.92,8.25 IC5.14
STB_BUFF
  Bottom 0.305: U1.5 15.37,26.04 17.65,23.75 IC5.6
STR7
  Bottom 0.305: IC5.3 13.84,23.11 12.19,24.77 8.51,24.77 7.75,25.53 U1.2
STR_SEG
  Bottom 0.406: JP4.3 7.37,16.26 8.25,15.37 8.25,10.29 10.03,8.51 14.35,8.51 15.11,9.27 IC5.17
TX2
  Bottom 0.406: U1.27 38.23,45.09 46.61,53.47 JP3.2
TX3
  Bottom 0.406: U1.35 17.91,43.69 20.19,45.97 20.19,53.09 18.54,54.74 JP6.8
VBAT
  Bottom 0.305: 67.51,28.07 67.51,23.62
  Bottom 0.406: 66.49,11 G1.+@4 | JP5.1 59.56,4.06
  Bottom 0.508: U1.21 53.97,43.18 71.5,43.18 72.77,41.91 72.77,37.34 71.88,36.45 68.58,36.45 67.51,35.38 67.51,28.07 | 67.51,23.62 67.51,12.91 G1.+@4 | 59.56,4.06 64.52,4.06 66.49,6.04 66.49,11
WIFI
  Bottom 0.406: JP6.7 14.86,52.2 15.88,51.18 TP2.TP
WIFI_ON
  Bottom 0.406: U1.34 R16.1

### Text on the board
Bottom: + | 1 | 1 | DPD_P4_7S_ver.1.4 | 1 | A